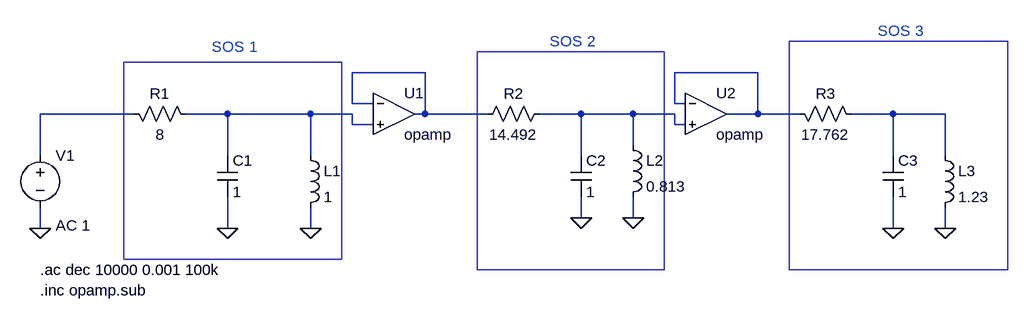
[diagram p0: schematic Normalizado.asc]
Normalizado.asc, the LTspice schematic file:
Version 4
SHEET 1 880 680
WIRE -1024 112 -1136 112
WIRE -512 112 -640 112
WIRE -1136 160 -1136 112
WIRE -1104 160 -1136 160
WIRE -640 160 -640 112
WIRE -624 160 -640 160
WIRE -1472 176 -1616 176
WIRE -1328 176 -1392 176
WIRE -1200 176 -1328 176
WIRE -1136 176 -1200 176
WIRE -1024 176 -1024 112
WIRE -1024 176 -1040 176
WIRE -928 176 -1024 176
WIRE -784 176 -848 176
WIRE -704 176 -784 176
WIRE -640 176 -704 176
WIRE -512 176 -512 112
WIRE -512 176 -560 176
WIRE -448 176 -512 176
WIRE -304 176 -368 176
WIRE -224 176 -304 176
WIRE -1136 192 -1136 176
WIRE -1104 192 -1136 192
WIRE -640 192 -640 176
WIRE -624 192 -640 192
WIRE -704 224 -704 176
WIRE -1616 240 -1616 176
WIRE -1328 240 -1328 176
WIRE -1200 240 -1200 176
WIRE -784 240 -784 176
WIRE -304 240 -304 176
WIRE -224 240 -224 176
WIRE -784 336 -784 304
WIRE -704 336 -704 304
WIRE -1616 352 -1616 320
WIRE -1328 352 -1328 304
WIRE -1200 352 -1200 320
WIRE -304 352 -304 304
WIRE -224 352 -224 320
FLAG -1616 352 0
FLAG -1328 352 0
FLAG -1200 352 0
FLAG -704 336 0
FLAG -784 336 0
FLAG -304 352 0
FLAG -224 352 0
SYMBOL voltage -1616 224 R0
WINDOW 123 24 124 Left 2
WINDOW 39 0 0 Left 0
SYMATTR InstName V1
SYMATTR Value ""
SYMATTR Value2 AC 1
SYMBOL res -1488 160 M90
WINDOW 0 0 56 VBottom 2
WINDOW 3 32 56 VTop 2
SYMATTR InstName R1
SYMATTR Value 8
SYMBOL cap -1344 240 R0
SYMATTR InstName C1
SYMATTR Value 1
SYMBOL ind -1216 224 R0
SYMATTR InstName L1
SYMATTR Value 1
SYMBOL OpAmps\\opamp -1072 112 R0
SYMATTR InstName U1
SYMBOL res -832 160 R90
WINDOW 0 0 56 VBottom 2
WINDOW 3 32 56 VTop 2
SYMATTR InstName R2
SYMATTR Value 14.492
SYMBOL cap -800 240 R0
SYMATTR InstName C2
SYMATTR Value 1
SYMBOL ind -720 208 R0
SYMATTR InstName L2
SYMATTR Value 0.813
SYMBOL OpAmps\\opamp -592 112 R0
SYMATTR InstName U2
SYMBOL res -464 160 M90
WINDOW 0 0 56 VBottom 2
WINDOW 3 32 56 VTop 2
SYMATTR InstName R3
SYMATTR Value 17.762
SYMBOL cap -320 240 R0
SYMATTR InstName C3
SYMATTR Value 1
SYMBOL ind -240 224 R0
SYMATTR InstName L3
SYMATTR Value 1.23
TEXT -1616 416 Left 2 !.ac dec 10000 0.001 100k
TEXT -1352 72 Left 2 ;SOS 1
TEXT -832 64 Left 2 ;SOS 2
TEXT -328 48 Left 2 ;SOS 3
TEXT -1616 448 Left 2 !.inc opamp.sub
RECTANGLE Normal -1152 400 -1488 96
RECTANGLE Normal -656 416 -944 80
RECTANGLE Normal -128 416 -464 64

The netlist it stands for:
* Normalizado.asc
V1 N003 0 AC 1
R1 N003 N004 8
C1 N004 0 1
L1 N004 0 1
XU1 N001 N004 N001 opamp Aol=100K GBW=10Meg  ; pins invin noninvin out
R2 N005 N001 14.492
C2 N005 0 1
L2 N005 0 0.813
XU2 N002 N005 N002 opamp Aol=100K GBW=10Meg  ; pins invin noninvin out
R3 N002 N006 17.762
C3 N006 0 1
L3 N006 0 1.23
.ac dec 10000 0.001 100k
* SOS 1
* SOS 2
* SOS 3
.inc opamp.sub
.backanno
.end